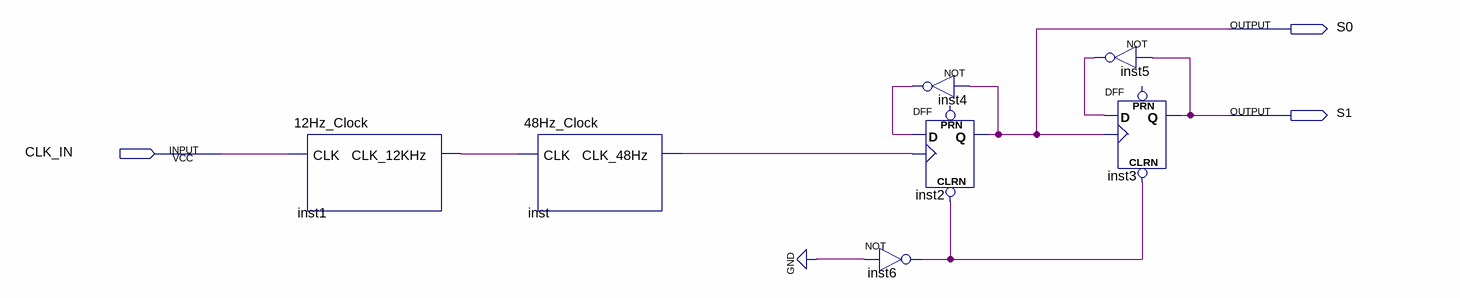
[diagram p0: schematic sheet]
// Quartus schematic Sequence_Slower.bdf as structural Verilog: 7 symbols, 3 pins
module Sequence_Slower (
  input  CLK_IN,
  output S0,
  output S1
);

  wire inst1_clk_12khz, inst4_out, inst5_out, inst6_out, inst_clk_48hz;

  \12Hz_Clock  inst1 (.CLK(CLK_IN), .CLK_12KHz(inst1_clk_12khz));
  \48Hz_Clock  inst (.CLK(inst1_clk_12khz), .CLK_48Hz(inst_clk_48hz));
  not inst6 (inst6_out, 1'b0);
  not inst4 (inst4_out, S0);
  DFF inst2 (.CLRN(inst6_out), .CLK(inst_clk_48hz), .D(inst4_out), .Q(S0));  // open: PRN
  not inst5 (inst5_out, S1);
  DFF inst3 (.CLRN(inst6_out), .CLK(S0), .D(inst5_out), .Q(S1));  // open: PRN
endmodule
